# Altium schematic sheet AO_Sheet.SchDoc
size A3
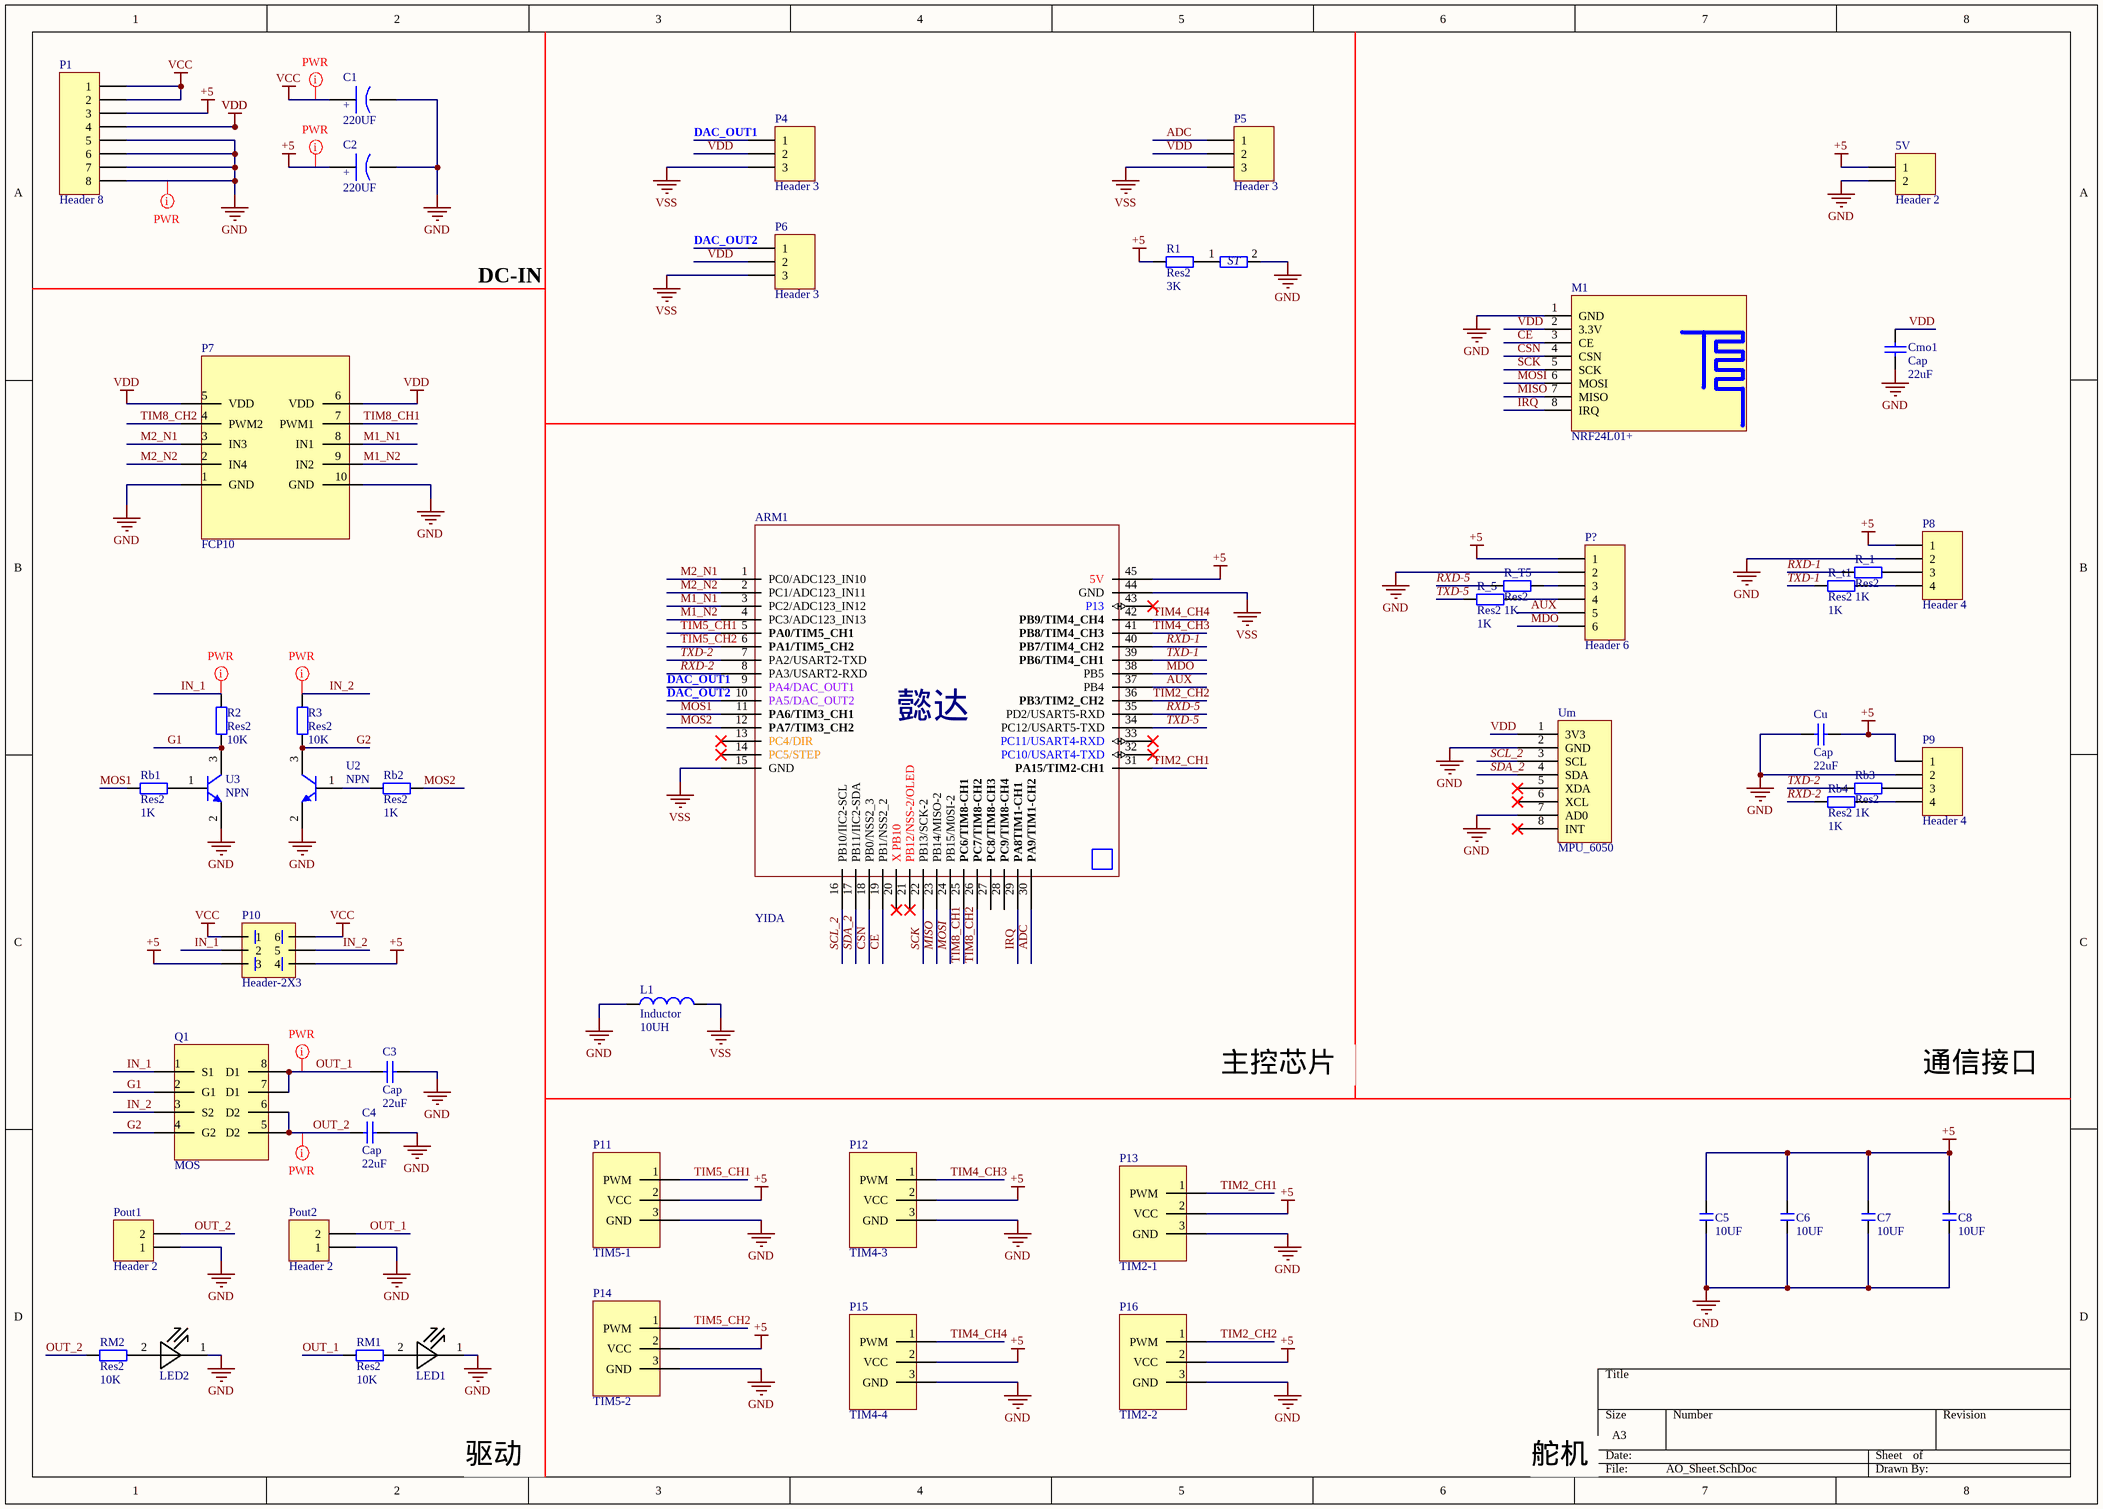
[diagram p0: AO_Sheet.SchDoc]

## Parts
5V  Header 2  [PH2.0-LI-2P]
ARM1  YIDA  [YIDA]
C1  220UF  [CAPE_E]
C2  220UF  [CAPE_E]
C3  Cap  value 22uF  [CAP_1206]
C4  Cap  value 22uF  [CAP_1206]
C5  10UF  [CAP_0603]
C6  10UF  [CAP_0603]
C7  10UF  [CAP_0603]
C8  10UF  [CAP_0603]
Cmo1  Cap  value 22uF  [CAP_1206]
Cu  Cap  value 22uF  [CAP_1206]
L1  Inductor  value 10UH  [Inductor_0603]
LED1  LED  [C0806]  (value not drawn)
LED2  LED  [C0806]  (value not drawn)
M1  NRF24L01+  [NRF24L01+B]
P1  Header 8  [XH2.54-WS-8P]
P4  Header 3  [Header 2.54X3]
P5  Header 3  [Header 2.54X3]
P6  Header 3  [Header 2.54X3]
P7  FCP10  [IDC_10P]
P8  Header 4  [UART]
P9  Header 4  [UART]
P10  Header-2X3  [Header 2.54_2X3]
P11  TIM5-1  [PWM_3]
P12  TIM4-3  [PWM_3]
P13  TIM2-1  [Header 2.54X3]
P14  TIM5-2  [PWM_3]
P15  TIM4-4  [PWM_3]
P16  TIM2-2  [Header 2.54X3]
P?  Header 6  [Header F 2.54X6]
Pout1  Header 2  [HT396R]
Pout2  Header 2  [Header 2.54X2]
Q1  MOS  [SOP_8_M]
R1  Res2  value 3K  [RESC_0603_2]
R2  Res2  value 10K  [RESC_0603_2]
R3  Res2  value 10K  [RESC_0603_2]
R_1  Res2  value 1K  [RESC_0603_2]
R_5  Res2  value 1K  [RESC_0603_2]
R_t1  Res2  value 1K  [RESC_0603_2]
R_T5  Res2  value 1K  [RESC_0603_2]
Rb1  Res2  value 1K  [RESC_0603_2]
Rb2  Res2  value 1K  [RESC_0603_2]
Rb3  Res2  value 1K  [RESC_0603_2]
Rb4  Res2  value 1K  [RESC_0603_2]
RM1  Res2  value 10K  [RESC_0603_2]
RM2  Res2  value 10K  [RESC_0603_2]
ST1  ST  [ST.yd]  (value not drawn)
U2  NPN  [SOT23_3]
U3  NPN  [SOT23_3]
Um  MPU_6050  [MPU-G521]

## Nets
+5: 5V.1 ARM1.45(5V) C2.1 C5.1 C6.1 C7.1 C8.1 Cu.2 P1.3 P8.1 P9.1 P10.3 P10.4 P11.2(VCC) P12.2(VCC) P13.2(VCC) P14.2(VCC) P15.2(VCC) P16.2(VCC) P?.1 R1.1
GND: 5V.2 C1.2 C2.2 C3.2 C4.1 C5.2 C6.2 C7.2 C8.2 Cmo1.1 Cu.1 L1.1 LED1.1(-) LED2.1(-) M1.1(GND) P1.5 P1.6 P1.7 P1.8 P7.1(GND) P7.10(GND) P8.2 P9.2 P11.3(GND) P12.3(GND) P13.3(GND) P14.3(GND) P15.3(GND) P16.3(GND) P?.2 Pout1.1 Pout2.1 ST1.2 U2.2(E) U3.2(E) Um.2(GND) Um.7(AD0)
VCC: C1.1 P1.1 P1.2 P10.1 P10.6
VDD: Cmo1.2 M1.2(3.3V) P1.4 P4.2 P5.2 P6.2 P7.5(VDD) P7.6(VDD) Um.1(3V3)
VSS: ARM1.15(GND) ARM1.44(GND) L1.2 P4.3 P5.3 P6.3
ADC: ARM1.30(PA9/TIM1-CH2) P5.1
AUX: ARM1.37(PB4) P?.5
CE: ARM1.19(PB1/NSS2_2) M1.3(CE)
CSN: ARM1.18(PB0/NSS2_3) M1.4(CSN)
DAC_OUT1: ARM1.9(PA4/DAC_OUT1) P4.1
DAC_OUT2: ARM1.10(PA5/DAC_OUT2) P6.1
G1: Q1.2(G1) R2.1 U3.3(C)
G2: Q1.4(G2) R3.1 U2.3(C)
IN_1: P10.2 Q1.1(S1) R2.2
IN_2: P10.5 Q1.3(S2) R3.2
IRQ: ARM1.29(PA8TIM1-CH1) M1.8(IRQ)
M1_N1: ARM1.3(PC2/ADC123_IN12) P7.8(IN1)
M1_N2: ARM1.4(PC3/ADC123_IN13) P7.9(IN2)
M2_N1: ARM1.1(PC0/ADC123_IN10) P7.3(IN3)
M2_N2: ARM1.2(PC1/ADC123_IN11) P7.2(IN4)
MDO: ARM1.38(PB5) P?.6
MISO: ARM1.23(PB14/MISO-2) M1.7(MISO)
MOS1: ARM1.11(PA6/TIM3_CH1) Rb1.1
MOS2: ARM1.12(PA7/TIM3_CH2) Rb2.1
MOSI: ARM1.24(PB15/M0SI-2) M1.6(MOSI)
OUT_1: C3.1 Pout2.2 Q1.7(D1) Q1.8(D1) RM1.2
OUT_2: C4.2 Pout1.2 Q1.5(D2) Q1.6(D2) RM2.2
RXD-1: ARM1.40(PB7/TIM4_CH2) R_1.2
RXD-2: ARM1.8(PA3/USART2-RXD) Rb4.2
RXD-5: ARM1.35(PD2/USART5-RXD) R_T5.2
SCK: ARM1.22(PB13/SCK-2) M1.5(SCK)
SCL_2: ARM1.16(PB10/IIC2-SCL) Um.3(SCL)
SDA_2: ARM1.17(PB11/IIC2-SDA) Um.4(SDA)
TIM2_CH1: ARM1.31(PA15/TIM2-CH1) P13.1(PWM)
TIM2_CH2: ARM1.36(PB3/TIM2_CH2) P16.1(PWM)
TIM4_CH3: ARM1.41(PB8/TIM4_CH3) P12.1(PWM)
TIM4_CH4: ARM1.42(PB9/TIM4_CH4) P15.1(PWM)
TIM5_CH1: ARM1.5(PA0/TIM5_CH1) P11.1(PWM)
TIM5_CH2: ARM1.6(PA1/TIM5_CH2) P14.1(PWM)
TIM8_CH1: ARM1.25(PC6/TIM8-CH1) P7.7(PWM1)
TIM8_CH2: ARM1.26(PC7/TIM8-CH2) P7.4(PWM2)
TXD-1: ARM1.39(PB6/TIM4_CH1) R_t1.2
TXD-2: ARM1.7(PA2/USART2-TXD) Rb3.2
TXD-5: ARM1.34(PC12/USART5-TXD) R_5.2
NetLED1_2: LED1.2(+) RM1.1
NetLED2_2: LED2.2(+) RM2.1
NetP8_3: P8.3 R_1.1
NetP8_4: P8.4 R_t1.1
NetP9_3: P9.3 Rb3.1
NetP9_4: P9.4 Rb4.1
NetP?_3: P?.3 R_T5.1
NetP?_4: P?.4 R_5.1
NetR1_2: R1.2 ST1.1
NetRb1_2: Rb1.2 U3.1(B)
NetRb2_2: Rb2.2 U2.1(B)

Not connected (* = marked no-connect by the designer): ARM1 13(PC4/DIR)* 14(PC5/STEP)* 20(X_PB10)* 21(PB12/NSS-2/OLED)* 27(PC8/TIM8-CH3) 28(PC9/TIM8-CH4) 32(PC10/USART4-TXD)* 33(PC11/USART4-RXD)* 43(P13)*; Um 5(XDA)* 6(XCL)* 8(INT)*

## Layout directives
mark named PWR: +5, GND, IN_1, IN_2, OUT_1, OUT_2, VCC

## Notes on the sheet
- DC-IN
- 主控芯片
- 通信接口
- 驱动
- 舵机
- (in symbol CAP) +
- (in symbol STM32-YIDA) 懿达

## Library data of the parts
5V Pout1 Pout2 = Header 2: Header, 2-Pin; LatestRevisionDate: 17-Jul-2002; LatestRevisionNote: Re-released for DXP Platform.; Publisher: Altium Limited
ARM1 = STM32-YIDA: MCU
C1 = CAP: CAP 12V ~ 50V
C2 = CAP: CAP 10V
C3 C4 Cmo1 Cu = Cap: Capacitor; Published: 8-Jun-2000; LatestRevisionDate: 17-Jul-2002; LatestRevisionNote: Re-released for DXP Platform.; PackageReference: RAD-0.3; Publisher: Altium Limited; PackageDescription: Radial Cap, Thru-Hole; 2 Leads; 0.3 in Pin Spacing
C5-C8 = CAP_SDM: CAP  12~50V
L1 = Inductor: Code_IEC: 1005; Published: 8-Jun-2000; LatestRevisionDate: 29-May-2009; LatestRevisionNote: IPC-7351 Footprint Added.; PackageReference: 0402-A; Publisher: Altium Limited; PackageDescription: Chip Inductor; Code_JEITA: 0402
LED1 LED2 = LED_R
M1 = NRF24L01+: 2.4G无线模块; 版权归属: 源创客; BOM名称: 2.4G无线模块; 学习资源: www.ooocke.com
P1 = Header 8: Header, 8-Pin; LatestRevisionDate: 17-Jul-2002; LatestRevisionNote: Re-released for DXP Platform.; Publisher: Altium Limited
P4-P6 = Header 3: Header, 3-Pin; LatestRevisionDate: 17-Jul-2002; LatestRevisionNote: Re-released for DXP Platform.; Publisher: Altium Limited
P7 = FC-P10: P10
P8 P9 = Header 4: Header, 4-Pin; LatestRevisionDate: 17-Jul-2002; LatestRevisionNote: Re-released for DXP Platform.; Publisher: Altium Limited
P10 = P3*2-2.54: Header
P11-P16 = PWM_D: Header
P? = Header 6: Header, 6-Pin; LatestRevisionDate: 17-Jul-2002; LatestRevisionNote: Re-released for DXP Platform.; Publisher: Altium Limited
Q1 = MOS-SOP8: MOS-P
R1-R3 R_1 R_5 R_t1 R_T5 Rb1-Rb4 RM1 RM2 = Res2: Resistor; Published: 8-Jun-2000; LatestRevisionDate: 17-Jul-2002; LatestRevisionNote: Re-released for DXP Platform.; PackageReference: AXIAL-0.4; Publisher: Altium Limited; PackageDescription: Axial Device, Thru-Hole; 2 Leads; 0.4 in Pin Spacing
ST1 = ST.YD: Logo
Um = MPU_6050: MPU